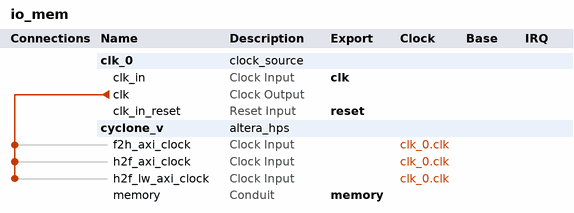
[diagram p0: system contents]
# Platform Designer (Qsys) system io_mem, Cyclone V 5CSXFC6D6F31C8ES
# Parameters at their usual value, and those the tool derives, are not listed.
package require -exact qsys 14.1
create_system io_mem
set_project_property DEVICE_FAMILY {Cyclone V}
set_project_property DEVICE 5CSXFC6D6F31C8ES

add_instance clk_0 clock_source 14.1
set_instance_parameter_value clk_0 clockFrequency 50000000

add_instance cyclone_v altera_hps 14.1
set_instance_parameter_value cyclone_v EMAC1_Mode N/A
set_instance_parameter_value cyclone_v EMAC1_PinMuxing Unused
set_instance_parameter_value cyclone_v F2SCLK_COLDRST_Enable false
set_instance_parameter_value cyclone_v F2SCLK_DBGRST_Enable false
set_instance_parameter_value cyclone_v F2SCLK_WARMRST_Enable false
set_instance_parameter_value cyclone_v F2SINTERRUPT_Enable false
set_instance_parameter_value cyclone_v F2S_Width 3
set_instance_parameter_value cyclone_v FPGA_PERIPHERAL_OUTPUT_CLOCK_FREQ_EMAC0_GTX_CLK 100
set_instance_parameter_value cyclone_v FPGA_PERIPHERAL_OUTPUT_CLOCK_FREQ_EMAC0_MD_CLK 100
set_instance_parameter_value cyclone_v FPGA_PERIPHERAL_OUTPUT_CLOCK_FREQ_EMAC1_GTX_CLK 100
set_instance_parameter_value cyclone_v FPGA_PERIPHERAL_OUTPUT_CLOCK_FREQ_EMAC1_MD_CLK 100
set_instance_parameter_value cyclone_v HPS_PROTOCOL DDR3
set_instance_parameter_value cyclone_v I2C0_Mode N/A
set_instance_parameter_value cyclone_v I2C0_PinMuxing Unused
set_instance_parameter_value cyclone_v I2C1_Mode N/A
set_instance_parameter_value cyclone_v I2C1_PinMuxing Unused
set_instance_parameter_value cyclone_v LWH2F_Enable true
set_instance_parameter_value cyclone_v MEM_BANKADDR_WIDTH 3
set_instance_parameter_value cyclone_v MEM_CLK_FREQ 300.0
set_instance_parameter_value cyclone_v MEM_CLK_FREQ_MAX 400.0
set_instance_parameter_value cyclone_v MEM_COL_ADDR_WIDTH 8
set_instance_parameter_value cyclone_v MEM_DQ_WIDTH 8
set_instance_parameter_value cyclone_v MEM_DRV_STR RZQ/6
set_instance_parameter_value cyclone_v MEM_ROW_ADDR_WIDTH 12
set_instance_parameter_value cyclone_v MEM_RTT_NOM RZQ/6
set_instance_parameter_value cyclone_v MEM_RTT_WR {Dynamic ODT off}
set_instance_parameter_value cyclone_v MEM_TCL 7
set_instance_parameter_value cyclone_v MEM_TFAW_NS 37.5
set_instance_parameter_value cyclone_v MEM_TINIT_US 499
set_instance_parameter_value cyclone_v MEM_TMRD_CK 3
set_instance_parameter_value cyclone_v MEM_TRAS_NS 40.0
set_instance_parameter_value cyclone_v MEM_TRCD_NS 15.0
set_instance_parameter_value cyclone_v MEM_TREFI_US 7.0
set_instance_parameter_value cyclone_v MEM_TRFC_NS 75.0
set_instance_parameter_value cyclone_v MEM_TRP_NS 15.0
set_instance_parameter_value cyclone_v MEM_TWTR 2
set_instance_parameter_value cyclone_v MEM_VENDOR JEDEC
set_instance_parameter_value cyclone_v MEM_WTCL 6
set_instance_parameter_value cyclone_v QSPI_Mode N/A
set_instance_parameter_value cyclone_v QSPI_PinMuxing Unused
set_instance_parameter_value cyclone_v REF_CLK_FREQ 125.0
set_instance_parameter_value cyclone_v S2F_Width 3
set_instance_parameter_value cyclone_v SDIO_Mode N/A
set_instance_parameter_value cyclone_v SDIO_PinMuxing Unused
set_instance_parameter_value cyclone_v SPIM1_Mode N/A
set_instance_parameter_value cyclone_v SPIM1_PinMuxing Unused
set_instance_parameter_value cyclone_v STM_Enable false
set_instance_parameter_value cyclone_v TIMING_BOARD_AC_SKEW 0.02
set_instance_parameter_value cyclone_v TIMING_BOARD_AC_TO_CK_SKEW 0.0
set_instance_parameter_value cyclone_v TIMING_BOARD_DQ_TO_DQS_SKEW 0.0
set_instance_parameter_value cyclone_v TIMING_BOARD_MAX_CK_DELAY 0.6
set_instance_parameter_value cyclone_v TIMING_BOARD_MAX_DQS_DELAY 0.6
set_instance_parameter_value cyclone_v TIMING_BOARD_SKEW_BETWEEN_DQS 0.02
set_instance_parameter_value cyclone_v TIMING_BOARD_SKEW_CKDQS_DIMM_MAX 0.01
set_instance_parameter_value cyclone_v TIMING_BOARD_SKEW_CKDQS_DIMM_MIN -0.01
set_instance_parameter_value cyclone_v TIMING_BOARD_SKEW_WITHIN_DQS 0.02
set_instance_parameter_value cyclone_v TIMING_TDH 125
set_instance_parameter_value cyclone_v TIMING_TDQSCK 400
set_instance_parameter_value cyclone_v TIMING_TDQSQ 120
set_instance_parameter_value cyclone_v TIMING_TDS 50
set_instance_parameter_value cyclone_v TIMING_TIH 250
set_instance_parameter_value cyclone_v TIMING_TIS 175
set_instance_parameter_value cyclone_v TIMING_TQSH 0.38
set_instance_parameter_value cyclone_v UART0_Mode N/A
set_instance_parameter_value cyclone_v UART0_PinMuxing Unused
set_instance_parameter_value cyclone_v USB1_Mode N/A
set_instance_parameter_value cyclone_v USB1_PinMuxing Unused
set_instance_parameter_value cyclone_v desired_cfg_clk_mhz 100.0
set_instance_parameter_value cyclone_v desired_qspi_clk_mhz 400.0

# connections
add_connection clk_0.clk cyclone_v.f2h_axi_clock clock
add_connection clk_0.clk cyclone_v.h2f_axi_clock clock
add_connection clk_0.clk cyclone_v.h2f_lw_axi_clock clock

# exported interfaces
add_interface clk clock sink
set_interface_property clk EXPORT_OF clk_0.clk_in
add_interface memory conduit end
set_interface_property memory EXPORT_OF cyclone_v.memory
add_interface reset reset sink
set_interface_property reset EXPORT_OF clk_0.clk_in_reset

set_interconnect_requirement {$system} qsys_mm.clockCrossingAdapter HANDSHAKE
set_interconnect_requirement {$system} qsys_mm.insertDefaultSlave FALSE
set_interconnect_requirement {$system} qsys_mm.maxAdditionalLatency 1

save_system io_mem.qsys
